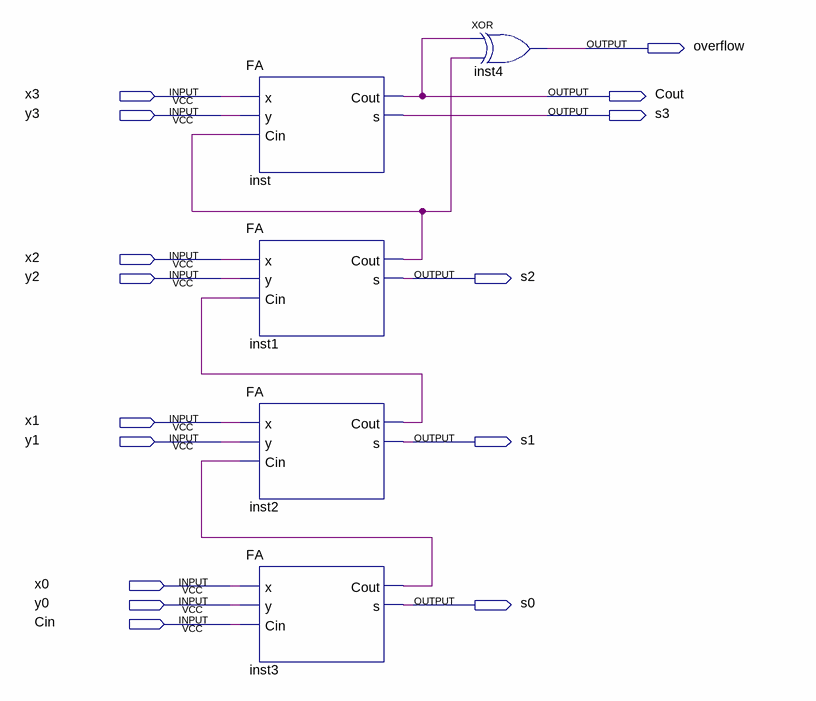
[diagram p0: schematic sheet]
// Quartus schematic Adder4Bit.bdf as structural Verilog: 5 symbols, 15 pins
module Adder4Bit (
  input  x3,
  input  y3,
  input  x2,
  input  y2,
  input  x1,
  input  y1,
  input  x0,
  input  y0,
  input  Cin,
  output overflow,
  output Cout,
  output s3,
  output s2,
  output s1,
  output s0
);

  wire inst1_cout, inst2_cout, inst3_cout;

  FA inst (.x(x3), .y(y3), .Cin(inst1_cout), .Cout(Cout), .s(s3));
  FA inst1 (.x(x2), .y(y2), .Cin(inst2_cout), .Cout(inst1_cout), .s(s2));
  FA inst2 (.x(x1), .y(y1), .Cin(inst3_cout), .Cout(inst2_cout), .s(s1));
  FA inst3 (.x(x0), .y(y0), .Cin(Cin), .Cout(inst3_cout), .s(s0));
  xor inst4 (overflow, Cout, inst1_cout);
endmodule
